# EasyEDA schematic Plocica.json
TITLE: Soccer Robot; REV: 1.0; Date: 2023-01-04; Sheet: 1/1; Drawn By: Ivan Kolaric; Company: Udruga "Robofreak"
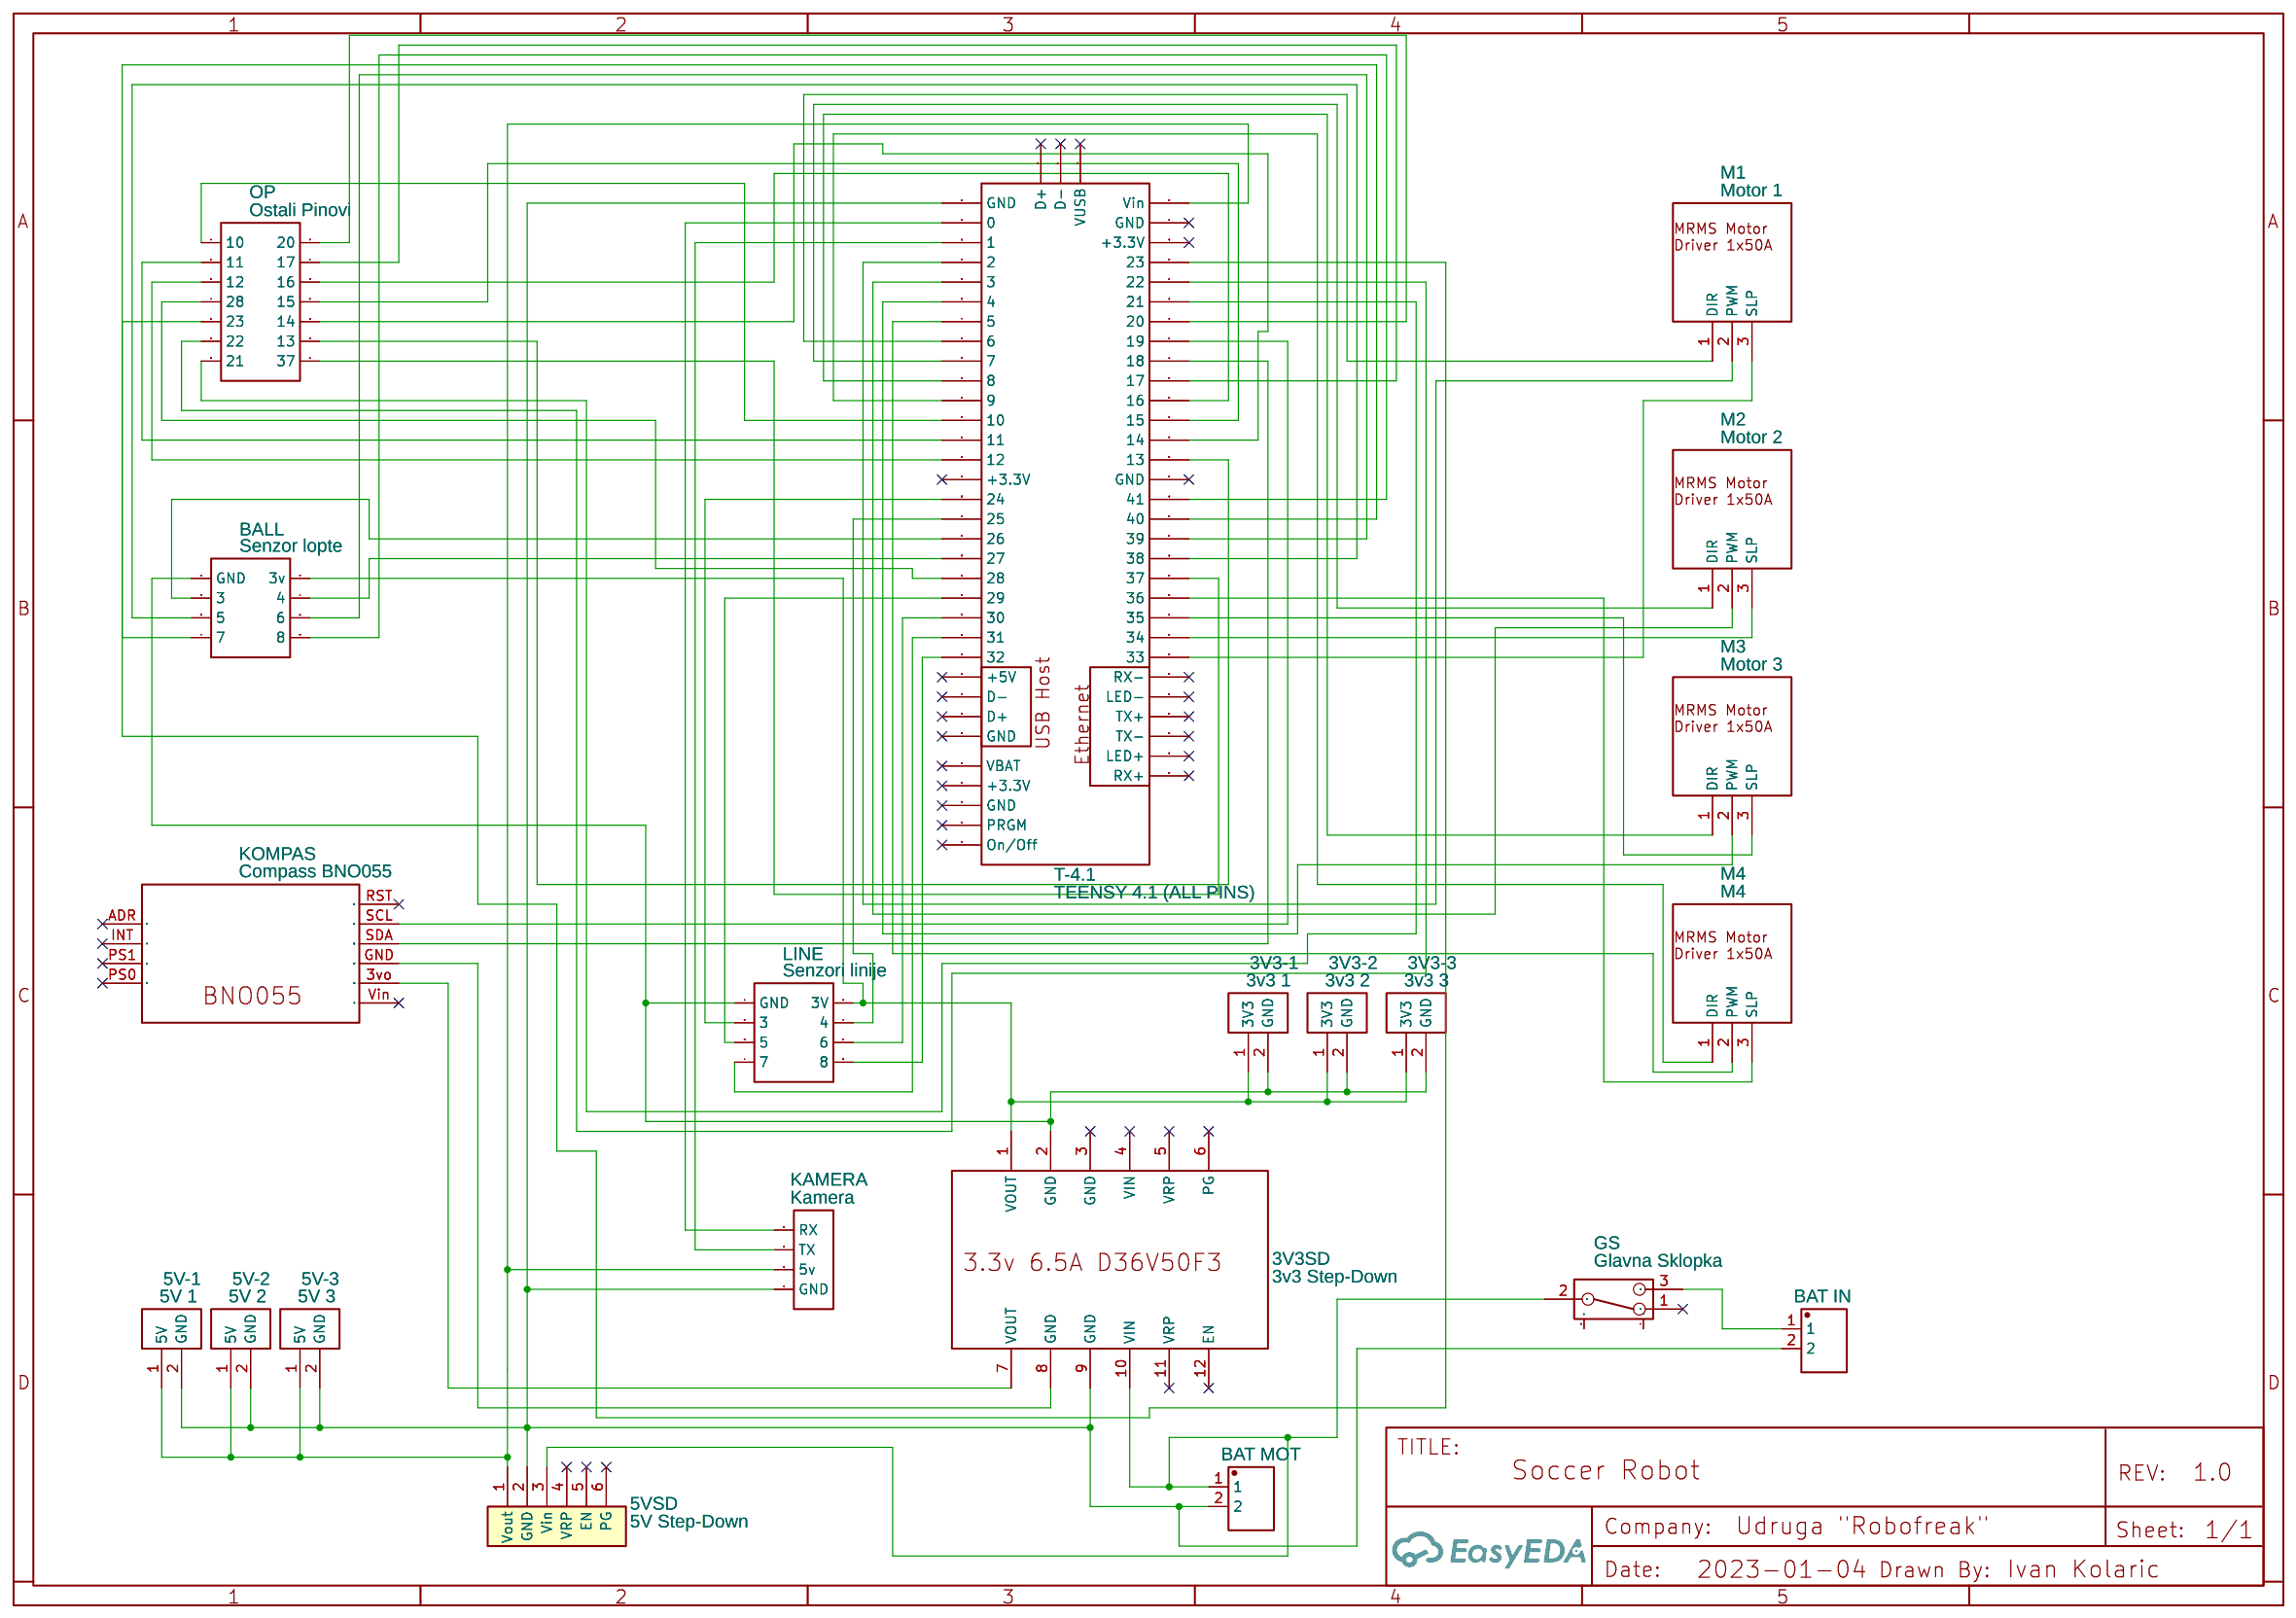
[diagram p0: schematic sheet]

## Parts
3V3-1  3v3 1  [MOLEX-KK254X2]
3V3-2  3v3 2  [MOLEX-KK254X2]
3V3-3  3v3 3  [MOLEX-KK254X2]
3V3SD  3v3 Step-Down  [D36V50F3]
5V-1  5V 1  [MOLEX-KK254X2]
5V-2  5V 2  [MOLEX-KK254X2]
5V-3  5V 3  [MOLEX-KK254X2]
5VSD  5V Step-Down  [D36V50F5]
BALL  Senzor lopte  [IDC-TH_8P-P2.54-V-R2-C4-S2.54]
BIN  BAT IN  [MOLEX L1NK 396 2P]
BMOT  BAT MOT  [MOLEX L1NK 396 2P]
GS  Glavna Sklopka  [SW-TH_SK-12D02VG3]
KAMERA  Kamera  [HDR-F-2.54_1X4]
KOMPAS  Compass BNO055  [BNO055]
LINE  Senzori linije  [IDC-TH_8P-P2.54-V-R2-C4-S2.54]
M1  Motor 1  [MRMS_MOTOR_DRIVER_1X50A_PCB]
M2  Motor 2  [MRMS_MOTOR_DRIVER_1X50A_PCB]
M3  Motor 3  [MRMS_MOTOR_DRIVER_1X50A_PCB]
M4  M4  [MRMS_MOTOR_DRIVER_1X50A_PCB]
OP  Ostali Pinovi  [IDC-TH_14P-P2.54-V-R2-C7-S2.54]
T-4  TEENSY 4.1 (ALL PINS)  [TEENSY-4.1-ALL-PINS]  (section 1)

## Library data of the parts
3V3-1-3V3-3 5V-1-5V-3 = MOLEX_KK254_2P VERT.: Manufacturer: MOLEX; Manufacturer Part: 22-11-2022; Supplier Part: 22-11-2022 MOLEX; Supplier: TME; link: https://www.tme.eu/cz/details/mx-6410-04a/signalove-konektory-raster-2-54mm/molex/22-27-2041/; Contributor: Micbelli
3V3SD = D36V50F3: Contributor: andrewmcdan
5VSD = STEP-DOWN POLOLU D36V50F5: Contributor: guillaume888; sourceId: YsmgyP7pj; Supplier: GoTronic
BALL LINE = HDR-IDC-2.54-2X4P: Supplier: LCSC; Manufacturer: BOOMELE; Manufacturer Part: IDC Box 2X4 2.54MM; image: //image.lceda.cn/szlcsc/C9135.jpg; Supplier Part: C9135
BIN BMOT = MOLEX L1NK 396 2P: Supplier: MOLEX; Manufacturer: MOLEX; Manufacturer Part: 2074790002; image: //image.lceda.cn/szlcsc/C10378.jpg; Supplier Part: C10378; Contributor: josemlopes
GS = SK-12D02-VG5: Supplier: LCSC; Supplier Part: C136722; Manufacturer: Rectangular Connectors - Contacts; Contributor: LCSC
KAMERA = HDR-F-2.54_1x4: Supplier Part: C225501; Supplier: LCSC; Contributor: LCEDA_Lib
KOMPAS = BNO055: Contributor: abdussamet28051999
M1-M4 = MRMS Motor Driver 1x50A Schematics: Contributor: andrija004
OP = HDR-IDC-2.54-2X7P: Supplier: LCSC; Manufacturer: BOOMELE; Manufacturer Part: 2X7 2.54mm IDC Box; image: //image.lceda.cn/szlcsc/C11215.jpg; Supplier Part: C11215
T-4 = TEENSY 4.1 (ALL PINS): Contributor: purpleprawn

## Nets
Net-(3V3-1-1): 3V3-1.1(3V3) 3V3-2.1(3V3) 3V3-3.1(3V3) 3V3SD.1(VOUT) BALL.2(3v) LINE.2(3V)
Net-(3V3-1-2): 3V3-1.2(GND) 3V3-2.2(GND) 3V3-3.2(GND) 3V3SD.2(GND) BALL.1(GND) LINE.1(GND)
Net-(3V3SD-7): 3V3SD.7(VOUT) KOMPAS.3vo
Net-(3V3SD-8): 3V3SD.8(GND) KOMPAS.GND
Net-(3V3SD-9): 3V3SD.9(GND) 5V-1.2(GND) 5V-2.2(GND) 5V-3.2(GND) 5VSD.2(GND) BIN.2 BMOT.2 KAMERA.4(GND) T-4.1(GND)
Net-(3V3SD-10): 3V3SD.10(VIN) 5VSD.3(Vin) BMOT.1 GS.2
Net-(5V-1-1): 5V-1.1(5V) 5V-2.1(5V) 5V-3.1(5V) 5VSD.1(Vout) KAMERA.3(5v) T-4.48(+3.3V)
Net-(BALL-3): BALL.3 T-4.18(26)
Net-(BALL-4): BALL.4 T-4.19(27)
Net-(BALL-5): BALL.5 T-4.30(38)
Net-(BALL-6): BALL.6 T-4.31(39)
Net-(BALL-7): BALL.7 T-4.32(40)
Net-(BALL-8): BALL.8 T-4.33(41)
Net-(BIN-1): BIN.1 GS.3
Net-(KAMERA-1): KAMERA.1(RX) T-4.2(0)
Net-(KAMERA-2): KAMERA.2(TX) T-4.3(1)
Net-(KOMPAS-SCL): KOMPAS.SCL T-4.41(19)
Net-(KOMPAS-SDA): KOMPAS.SDA T-4.40(18)
Net-(LINE-3): LINE.3 T-4.16(24)
Net-(LINE-4): LINE.4 T-4.17(25)
Net-(LINE-5): LINE.5 T-4.21(29)
Net-(LINE-6): LINE.6 T-4.22(30)
Net-(LINE-7): LINE.7 T-4.23(31)
Net-(LINE-8): LINE.8 T-4.24(32)
Net-(M1-1): M1.1(DIR) T-4.8(6)
Net-(M1-2): M1.2(PWM) T-4.4(2)
Net-(M1-3): M1.3(SLP) T-4.25(33)
Net-(M2-1): M2.1(DIR) T-4.9(7)
Net-(M2-2): M2.2(PWM) T-4.5(3)
Net-(M2-3): M2.3(SLP) T-4.26(34)
Net-(M3-1): M3.1(DIR) T-4.10(8)
Net-(M3-2): M3.2(PWM) T-4.6(4)
Net-(M3-3): M3.3(SLP) T-4.27(35)
Net-(M4-1): M4.1(DIR) T-4.11(9)
Net-(M4-2): M4.2(PWM) T-4.7(5)
Net-(M4-3): M4.3(SLP) T-4.28(36)
Net-(OP-1): OP.1(10) T-4.12(10)
Net-(OP-2): OP.2(20) T-4.42(GND)
Net-(OP-3): OP.3(11) T-4.13(11)
Net-(OP-4): OP.4(17) T-4.39(17)
Net-(OP-5): OP.5(12) T-4.14(12)
Net-(OP-6): OP.6(16) T-4.38(16)
Net-(OP-7): OP.7(28) T-4.20(28)
Net-(OP-8): OP.8(15) T-4.37(15)
Net-(OP-9): OP.9(23) T-4.45(+5V)
Net-(OP-10): OP.10(14) T-4.36(14)
Net-(OP-11): OP.11(22) T-4.44(D-)
Net-(OP-12): OP.12(13) T-4.35(13)
Net-(OP-13): OP.13(21) T-4.43(D+)
Net-(OP-14): OP.14(37) T-4.29(37)

Not connected (* = marked no-connect by the designer): 3V3SD 3(GND)* 4(VIN)* 5(VRP)* 6(PG)* 11(VRP)* 12(EN)*; 5VSD 4(VRP)* 5(EN)* 6(PG)*; GS 1* 4 5; KOMPAS ADR* INT* PS0* PS1* RST* Vin*; T-4 15(+3.3V)* 34(GND)* 46(+3.3V)* 47(VBAT)* 49(GND)* 50(PRGM)* 51(On/Off)* 52(VUSB)* 60(RX+)* 61(LED+)* 62(TX-)* 63(TX+)* 64(LED-)* 65(RX-)* 66(D+)* 67(D-)*
